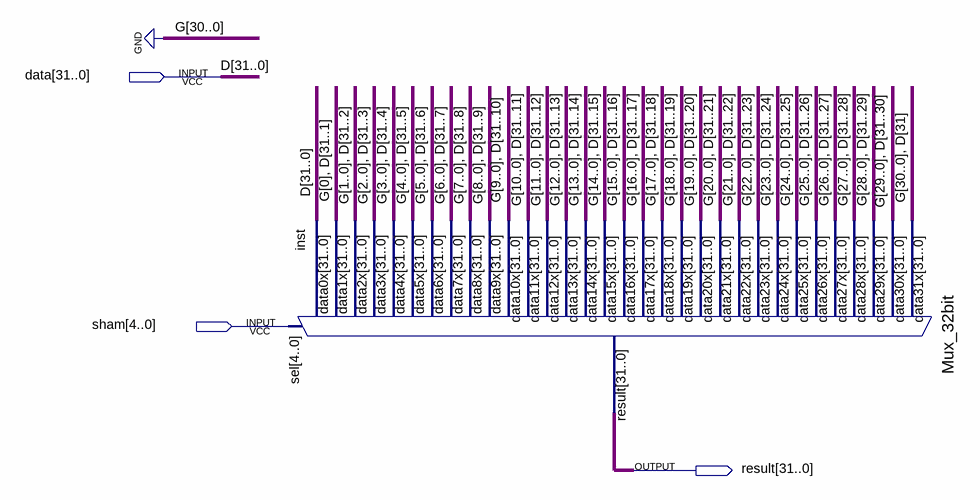
[diagram p0: schematic sheet]
// Quartus schematic right_shift.bdf as structural Verilog: 1 symbols, 3 pins
module right_shift (
  input  [31:0] data,
  input  [4:0] sham,
  output [31:0] result
);

  Mux_32bit inst (
    .data31x({{31{1'b0}}, data[31]}), .data30x({{30{1'b0}}, data[31:30]}),
    .data29x({{29{1'b0}}, data[31:29]}), .data28x({{28{1'b0}}, data[31:28]}),
    .data27x({{27{1'b0}}, data[31:27]}), .data26x({{26{1'b0}}, data[31:26]}),
    .data25x({{25{1'b0}}, data[31:25]}), .data24x({{24{1'b0}}, data[31:24]}),
    .data23x({{23{1'b0}}, data[31:23]}), .data22x({{22{1'b0}}, data[31:22]}),
    .data21x({{21{1'b0}}, data[31:21]}), .data20x({{20{1'b0}}, data[31:20]}),
    .data19x({{19{1'b0}}, data[31:19]}), .data18x({{18{1'b0}}, data[31:18]}),
    .data17x({{17{1'b0}}, data[31:17]}), .data16x({{16{1'b0}}, data[31:16]}),
    .data15x({{15{1'b0}}, data[31:15]}), .data14x({{14{1'b0}}, data[31:14]}),
    .data13x({{13{1'b0}}, data[31:13]}), .data12x({{12{1'b0}}, data[31:12]}),
    .data11x({{11{1'b0}}, data[31:11]}), .data10x({{10{1'b0}}, data[31:10]}),
    .data9x({{9{1'b0}}, data[31:9]}), .data8x({{8{1'b0}}, data[31:8]}), .data7x({{7{1'b0}}, data[31:7]}),
    .data6x({{6{1'b0}}, data[31:6]}), .data5x({{5{1'b0}}, data[31:5]}), .data4x({4'b0000, data[31:4]}),
    .data3x({3'b000, data[31:3]}), .data2x({2'b00, data[31:2]}), .data1x({1'b0, data[31:1]}), .data0x(data),
    .sel(sham), .result(result));

  // Other names for the same wires on the sheet: D[31:0] = data
endmodule
